# Altium schematic sheet 48V_Converter.SchDoc
size A; SheetNumber: 8; SheetTotal: 9
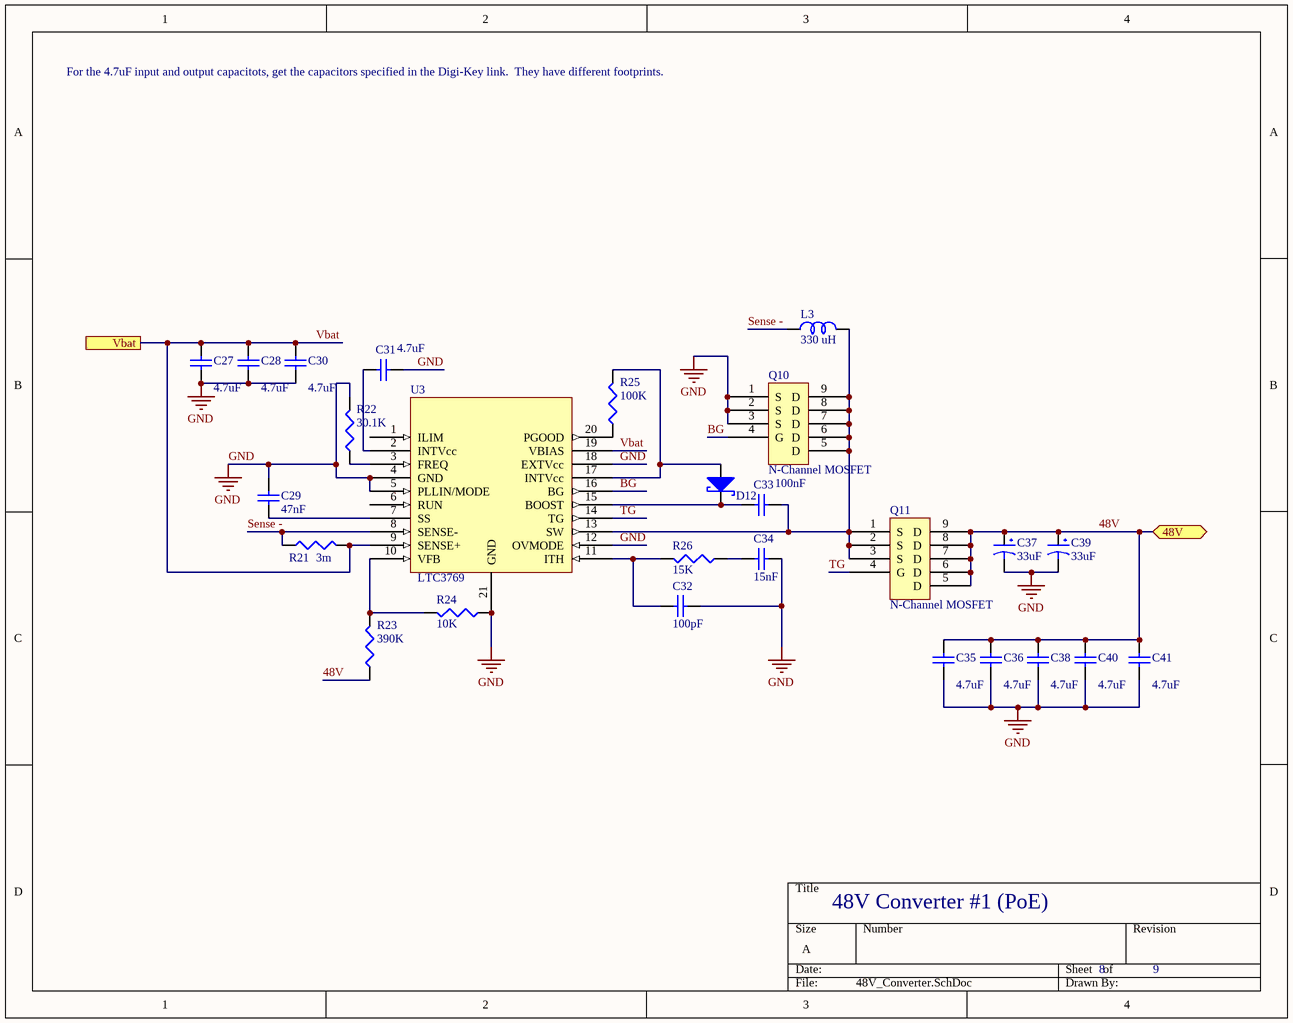
[diagram p0: 48V_Converter.SchDoc]

## Parts
C27  value 4.7uF  [C1210]  (hidden comment: HMK325C7475KN-TE)
C28  value 4.7uF  [C1210]  (hidden comment: HMK325C7475KN-TE)
C29  value 47nF  [C1206]  (hidden comment: Cap Semi)
C30  value 4.7uF  [C1210]  (hidden comment: HMK325C7475KN-TE)
C31  value 4.7uF  [C1206]  (hidden comment: Cap Semi)
C32  value 100pF  [C1206]  (hidden comment: Cap Semi)
C33  value 100nF  [C1206]  (hidden comment: Cap Semi)
C34  value 15nF  [C1206]  (hidden comment: Cap Semi)
C35  value 4.7uF  [C1210]  (hidden comment: HMK325C7475KN-TE)
C36  value 4.7uF  [C1210]  (hidden comment: HMK325C7475KN-TE)
C37  33uF  [UUX1J330MNL6GS]
C38  value 4.7uF  [C1210]  (hidden comment: HMK325C7475KN-TE)
C39  33uF  [UUX1J330MNL6GS]
C40  value 4.7uF  [C1210]  (hidden comment: HMK325C7475KN-TE)
C41  value 4.7uF  [C1210]  (hidden comment: HMK325C7475KN-TE)
D12  SCHOTTKY  [BAS170W]  (value not drawn)
L3  330 uH  [PQ2617BHA-330K]
Q10  N-Channel MOSFET  [BSC028N06LS3]
Q11  N-Channel MOSFET  [BSC028N06LS3]
R21  value 3m  [12Z-2010]  (hidden comment: Res3)
R22  value 30.1K  [J1-0603]  (hidden comment: Res3)
R23  value 390K  [J1-0603]  (hidden comment: Res3)
R24  value 10K  [J1-0603]  (hidden comment: Res3)
R25  value 100K  [J1-0603]  (hidden comment: Res3)
R26  value 15K  [J1-0603]  (hidden comment: Res3)
U3  LTC3769  [LTC3769]

## Ports
48V (bidir), Vbat

## Nets
GND: C27.1 C28.1 C29.2 C30.1 C31.1 C32.1 C34.1 C35.1 C36.1 C37.2 C38.1 C39.2 C40.1 C41.1 Q10.1(S) Q10.2(S) Q10.3(S) R22.2 R24.1 U3.4(GND) U3.5(PLLIN/MODE) U3.12(OVMODE) U3.18(EXTVcc) U3.21(GND)
48V: C35.2 C36.2 C37.1 C38.2 C39.1 C40.2 C41.2 Q11.5(D) Q11.6(D) Q11.7(D) Q11.8(D) Q11.9(D) R23.1 ; port 48V
BG: Q10.4(G) U3.16(BG)
Sense -: L3.2 R21.1 U3.8(SENSE-)
TG: Q11.4(G) U3.14(TG)
Vbat: C27.2 C28.2 C30.2 R21.2 U3.9(SENSE+) U3.19(VBIAS) ; port Vbat
NetC29_1: C29.1 U3.7(SS)
NetC31_2: C31.2 U3.2(INTVcc)
NetC32_2: C32.2 R26.2 U3.11(ITH)
NetC33_1: C33.1 L3.1 Q10.5(D) Q10.6(D) Q10.7(D) Q10.8(D) Q10.9(D) Q11.1(S) Q11.2(S) Q11.3(S) U3.13(SW)
NetC33_2: C33.2 D12.K(Cathode) U3.15(BOOST)
NetC34_2: C34.2 R26.1
NetD12_A: D12.A(Anode) R25.2 U3.17(INTVcc)
NetR22_1: R22.1 U3.3(FREQ)
NetR23_2: R23.2 R24.2 U3.10(VFB)
NetR25_1: R25.1 U3.20(PGOOD)

Not connected (* = marked no-connect by the designer): U3 1(ILIM) 6(RUN)

## Notes on the sheet
- For the 4.7uF input and output capacitots, get the capacitors specified in the Digi-Key link.  They have different footprints.
- 48V Converter #1 (PoE)

## Library data of the parts
C27-C36 C38 C40 C41 = Cap Semi: Capacitor (Semiconductor SIM Model); Published: 8-Jun-2000; LatestRevisionDate: 29-May-2009; LatestRevisionNote: IPC-7351 Footprint Added.; PackageReference: C1206; Publisher: Altium Limited; PackageDescription: Chip Capacitor
  C27 C28 C30 C35 C36 C38 C40 C41: ComponentLink1Description: Datasheet; ComponentLink1URL: https://www.yuden.co.jp/productdata/catalog/mlcc06_e.pdf; ComponentLink2Description: Digi-Key; ComponentLink2URL: https://www.digikey.com/product-detail/en/taiyo-yuden/HMK325C7475KN-TE/587-5038-1-ND/6563881
C37 C39 = UUX1J330MNL6GS: CAP ALUM 33UF 20% 63V SMD; Digikey: https://www.digikey.com/product-detail/en/nichicon/UWX1C100MCL2GB/493-2099-1-ND/590074; Datasheet: http://nichicon-us.com/english/products/pdfs/e-uwx.pdf; ComponentLink1Description: Digi-Key; ComponentLink1URL: https://www.digikey.com/product-detail/en/nichicon/UUX1J330MNL6GS/493-9972-1-ND/3974043; ComponentLink2Description: Datasheet; ComponentLink2URL: https://www.nichicon.co.jp/english/products/pdfs/e-uux.pdf
D12 = BAS170W: DIODE SCHOTTKY 70V 70MA SOD323-2; ComponentLink1Description: Digi-Key; ComponentLink1URL: https://www.digikey.com/product-detail/en/infineon-technologies/BAS170WE6327HTSA1/BAS170WE6327HTSA1CT-ND/3819495; ComponentLink2Description: Datasheet; ComponentLink2URL: https://www.infineon.com/dgdl/Infineon-BAS70series-DataSheet-v01_00-EN.pdf?fileId=5546d4626d66c2b1016d73f7ecf220d6&redirId=117942
L3 = PQ2617BHA-330K: 33µH Shielded Wirewound Inductor 28A 2.5mOhm Max Nonstandard; ComponentLink1Description: Datasheet; ComponentLink1URL: https://www.bourns.com/docs/Product-Datasheets/PQ2617.pdf; ComponentLink2Description: Digi-Key; ComponentLink2URL: https://www.digikey.com/product-detail/en/bourns-inc/PQ2617BHA-330K/PQ2617BHA-330K-ND/7695918
Q10 Q11 = BSC028N06LS3: ComponentLink1Description: Datasheet; ComponentLink1URL: https://www.mouser.com/datasheet/2/196/Infineon-BSC028N06LS3-DS-v02_02-en-1226498.pdf
R21-R26 = Res3: Resistor; Published: 8-Jun-2000; LatestRevisionDate: 29-May-2009; LatestRevisionNote: IPC-7351 Footprint Added.; PackageReference: J1-0603; Publisher: Altium Limited; PackageDescription: Chip Resistor
U3 = LTC3769: 48V Switching converter; ComponentLink1Description: Analog Devices; ComponentLink1URL: https://www.analog.com/en/products/ltc3769.html#; ComponentLink2Description: Datasheet; ComponentLink2URL: https://www.analog.com/media/en/technical-documentation/data-sheets/3769fa.pdf